# EAGLE design Matrix2 (EAGLE 5.06)
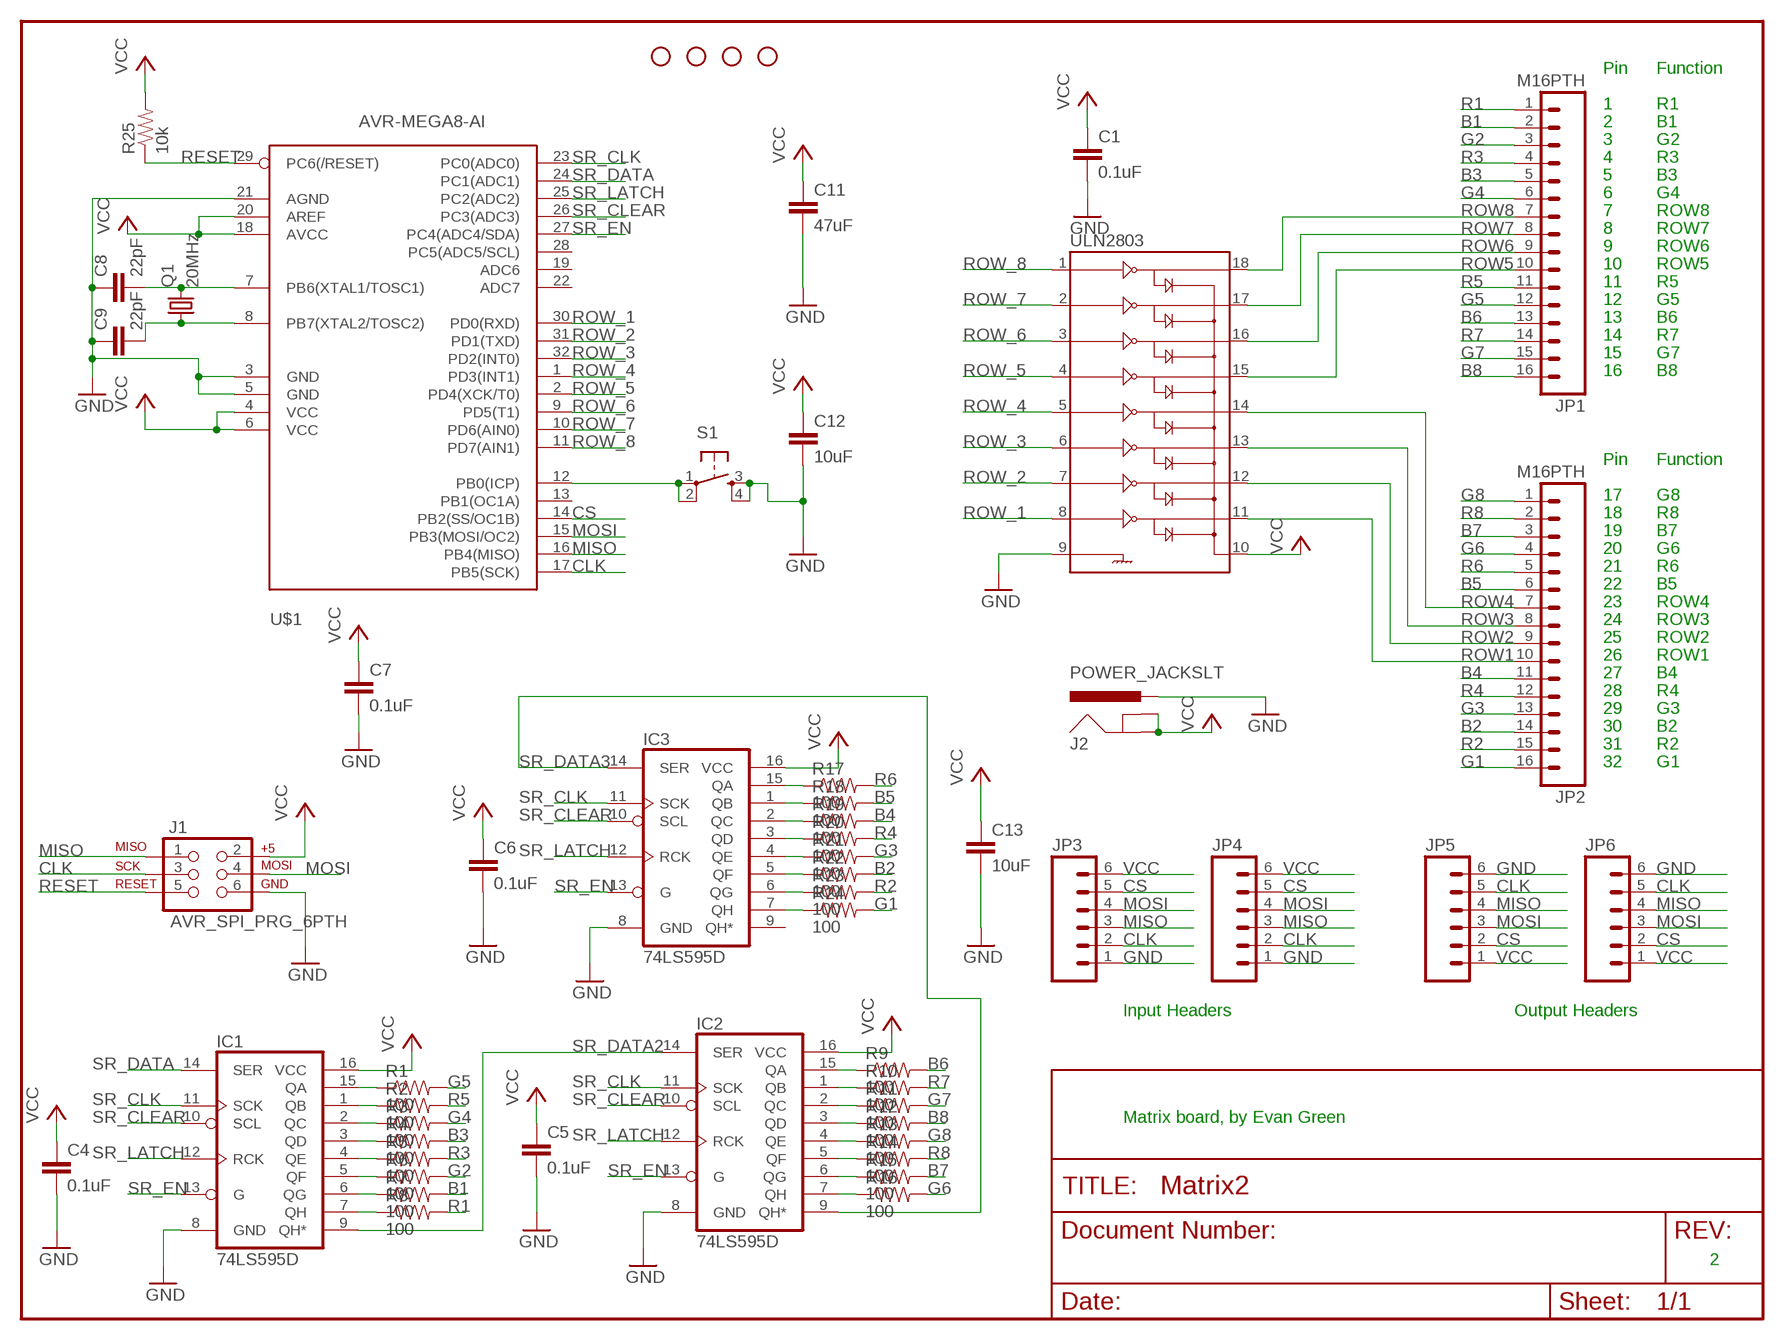
[diagram p0: schematic, sheet 1]

## Parts
C1  0.1uF  CAP0402-CAP  [0402-CAP]
C4  0.1uF  CAP0402-CAP  [0402-CAP]
C5  0.1uF  CAP0402-CAP  [0402-CAP]
C6  0.1uF  CAP0402-CAP  [0402-CAP]
C7  0.1uF  CAP0402-CAP  [0402-CAP]
C8  22pF  CAP0402-CAP  [0402-CAP]
C9  22pF  CAP0402-CAP  [0402-CAP]
C11  47uF  CAP1210  [1210]
C12  10uF  CAP1210  [1210]
C13  10uF  CAP1210  [1210]
IC1  74LS595D  [SO16]
IC2  74LS595D  [SO16]
IC3  74LS595D  [SO16]
J1  AVR_SPI_PRG_6PTH  [2X3]
J2  POWER_JACKSLT  [POWER_JACK_SLOT]
JP1  M16PTH  [1X16]
JP2  M16PTH  [1X16]
JP3  M06SIP  [1X06]
JP4  M06SIP  [1X06]
JP5  M06SIP  [1X06]
JP6  M06SIP  [1X06]
JP7  STAND-OFF  [STAND-OFF]
JP8  STAND-OFF  [STAND-OFF]
JP9  STAND-OFF  [STAND-OFF]
JP10  STAND-OFF  [STAND-OFF]
Q1  20MHz  CRYSTALHC49US  [HC49US]
R1  100  RESISTOR0402-RES  [0402-RES]
R2  100  RESISTOR0402-RES  [0402-RES]
R3  100  RESISTOR0402-RES  [0402-RES]
R4  100  RESISTOR0402-RES  [0402-RES]
R5  100  RESISTOR0402-RES  [0402-RES]
R6  100  RESISTOR0402-RES  [0402-RES]
R7  100  RESISTOR0402-RES  [0402-RES]
R8  100  RESISTOR0402-RES  [0402-RES]
R9  100  RESISTOR0402-RES  [0402-RES]
R10  100  RESISTOR0402-RES  [0402-RES]
R11  100  RESISTOR0402-RES  [0402-RES]
R12  100  RESISTOR0402-RES  [0402-RES]
R13  100  RESISTOR0402-RES  [0402-RES]
R14  100  RESISTOR0402-RES  [0402-RES]
R15  100  RESISTOR0402-RES  [0402-RES]
R16  100  RESISTOR0402-RES  [0402-RES]
R17  100  RESISTOR0402-RES  [0402-RES]
R18  100  RESISTOR0402-RES  [0402-RES]
R19  100  RESISTOR0402-RES  [0402-RES]
R20  100  RESISTOR0402-RES  [0402-RES]
R21  100  RESISTOR0402-RES  [0402-RES]
R22  100  RESISTOR0402-RES  [0402-RES]
R23  100  RESISTOR0402-RES  [0402-RES]
R24  100  RESISTOR0402-RES  [0402-RES]
R25  10k  RESISTOR0402-RES  [0402-RES]
S1  TAC_SWITCHSMD  [TACTILE_SWITCH_SMD]
U$1  AVR-MEGA8-AI  [TQFP32-08]
ULN2803  ULN2803SOICW  [SO18L]

## Nets
B1: JP1.2 R7.2
B2: JP2.14 R22.2
B3: JP1.5 R4.2
B4: JP2.11 R19.2
B5: JP2.6 R18.2
B6: JP1.13 R9.2
B7: JP2.3 R15.2
B8: JP1.16 R12.2
CLK: J1.3 JP3.2 JP4.2 JP5.5 JP6.5 U$1.17(PB5(SCK))
CS: JP3.5 JP4.5 JP5.2 JP6.2 U$1.14(PB2(SS/OC1B))
G1: JP2.16 R24.2
G2: JP1.3 R6.2
G3: JP2.13 R21.2
G4: JP1.6 R3.2
G5: JP1.12 R1.2
G6: JP2.4 R16.2
G7: JP1.15 R11.2
G8: JP2.1 R13.2
GND: C1.2 C4.2 C5.2 C6.2 C7.2 C8.1 C9.1 C11.2 C12.2 C13.2 IC1.8(GND) IC2.8(GND) IC3.8(GND) J1.6 J2.PWR JP3.1 JP4.1 JP5.6 JP6.6 S1.3 S1.4 U$1.3(GND) U$1.5(GND) U$1.21(AGND) ULN2803.9
MISO: J1.1 JP3.3 JP4.3 JP5.4 JP6.4 U$1.16(PB4(MISO))
MOSI: J1.4 JP3.4 JP4.4 JP5.3 JP6.3 U$1.15(PB3(MOSI/OC2))
N$1: IC1.15(QA) R1.1
N$2: IC1.1(QB) R2.1
N$3: IC1.2(QC) R3.1
N$4: IC1.3(QD) R4.1
N$5: IC1.4(QE) R5.1
N$6: IC1.5(QF) R6.1
N$7: IC1.6(QG) R7.1
N$8: IC1.7(QH) R8.1
N$9: IC2.15(QA) R9.1
N$10: IC2.1(QB) R10.1
N$11: IC2.2(QC) R11.1
N$12: IC2.3(QD) R12.1
N$13: IC2.4(QE) R13.1
N$14: IC2.5(QF) R14.1
N$15: IC2.6(QG) R15.1
N$16: IC2.7(QH) R16.1
N$17: IC3.15(QA) R17.1
N$18: IC3.1(QB) R18.1
N$19: IC3.2(QC) R19.1
N$20: IC3.3(QD) R20.1
N$21: IC3.4(QE) R21.1
N$22: IC3.5(QF) R22.1
N$23: IC3.6(QG) R23.1
N$24: IC3.7(QH) R24.1
N$25: C8.2 Q1.2 U$1.7(PB6(XTAL1/TOSC1))
N$26: C9.2 Q1.1 U$1.8(PB7(XTAL2/TOSC2))
N$27: S1.1 S1.2 U$1.12(PB0(ICP))
R1: JP1.1 R8.2
R2: JP2.15 R23.2
R3: JP1.4 R5.2
R4: JP2.12 R20.2
R5: JP1.11 R2.2
R6: JP2.5 R17.2
R7: JP1.14 R10.2
R8: JP2.2 R14.2
RESET: J1.5 R25.1 U$1.29(PC6(/RESET))
ROW1: JP2.10 ULN2803.11
ROW2: JP2.9 ULN2803.12
ROW3: JP2.8 ULN2803.13
ROW4: JP2.7 ULN2803.14
ROW5: JP1.10 ULN2803.15
ROW6: JP1.9 ULN2803.16
ROW7: JP1.8 ULN2803.17
ROW8: JP1.7 ULN2803.18
ROW_1: U$1.30(PD0(RXD)) ULN2803.8
ROW_2: U$1.31(PD1(TXD)) ULN2803.7
ROW_3: U$1.32(PD2(INT0)) ULN2803.6
ROW_4: U$1.1(PD3(INT1)) ULN2803.5
ROW_5: U$1.2(PD4(XCK/T0)) ULN2803.4
ROW_6: U$1.9(PD5(T1)) ULN2803.3
ROW_7: U$1.10(PD6(AIN0)) ULN2803.2
ROW_8: U$1.11(PD7(AIN1)) ULN2803.1
SR_CLEAR: IC1.10(SCL) IC2.10(SCL) IC3.10(SCL) U$1.26(PC3(ADC3))
SR_CLK: IC1.11(SCK) IC2.11(SCK) IC3.11(SCK) U$1.23(PC0(ADC0))
SR_DATA: IC1.14(SER) U$1.24(PC1(ADC1))
SR_DATA2: IC1.9(QH*) IC2.14(SER)
SR_DATA3: IC2.9(QH*) IC3.14(SER)
SR_EN: IC1.13(G) IC2.13(G) IC3.13(G) U$1.27(PC4(ADC4/SDA))
SR_LATCH: IC1.12(RCK) IC2.12(RCK) IC3.12(RCK) U$1.25(PC2(ADC2))
VCC: C1.1 C4.1 C5.1 C6.1 C7.1 C11.1 C12.1 C13.1 IC1.16(VCC) IC2.16(VCC) IC3.16(VCC) J1.2 J2.GND@1(GNDBREAK) J2.GND@2(GND) JP3.6 JP4.6 JP5.1 JP6.1 R25.2 U$1.4(VCC) U$1.6(VCC) U$1.18(AVCC) U$1.20(AREF) ULN2803.10
Unconnected: IC3.9(QH*) U$1.13(PB1(OC1A)) U$1.19(ADC6) U$1.22(ADC7) U$1.28(PC5(ADC5/SCL))

## Notes on the sheet
- Pin | Function
- 1 | R1
- 2 | B1
- 3 | G2
- 4 | R3
- 5 | B3
- 6 | G4
- 7 | ROW8
- 8 | ROW7
- 9 | ROW6
- 10 | ROW5
- 11 | R5
- 12 | G5
- 13 | B6
- 14 | R7
- 15 | G7
- 16 | B8
- Pin | Function
- 17 | G8
- 18 | R8
- 19 | B7
- 20 | G6
- 21 | R6
- 22 | B5
- 23 | ROW4
- 24 | ROW3
- 25 | ROW2
- 26 | ROW1
- 27 | B4
- 28 | R4
- 29 | G3
- 30 | B2
- 31 | R2
- 32 | G1
- Input Headers | Output Headers
- Matrix board, by Evan Green
- 2

## Library data of the parts
C1 C4-C9 C11-C13 = SparkFun:CAP: Capacitor Standard 0603 ceramic capacitor, and 0.1" leaded capacitor.
IC1-IC3 = SparkFun:74*595: 8-bit SHIFT REGISTER, output latch
J1 = SparkFun:AVR_SPI_PRG_6: AVR ISP 6 Pin This is the reduced ISP connector for AVR programming. Common on Arduino. This footprint will take up less PCB space and can be used with a 10-pin to 6-pin adapter such as SKU: BOB-08508
J2 = SparkFun:POWER_JACK: Power Jack This is the standard 5.5mm barrel jack for power. The PTH is the most common, proven, reliable, footprint. All others are experimental. The Slot footprint only works if the mill layer is transmitted to the PCB fab house so be warned. Spark Fun Electronics SKU : PRT-00119. Mating wall wart : TOL-00298 (and others)
JP1 JP2 = SparkFun:M16
JP3-JP6 = SparkFun:M06: Header 6 Standard 6-pin 0.1" header. Use with straight break away headers (SKU : PRT-00116), right angle break away headers (PRT-00553), swiss pins (PRT-00743), machine pins (PRT-00117), and female headers (PRT-00115). Molex polarized connector foot print use with SKU : PRT-08094 with associated crimp pins and housings. NOTES ON THE VARIANTS LOCK and LOCK_LONGPADS... This footprint was designed to help hold the alignment of a through-hole component (i.e. 6-pin header) while soldering it into place. You may notice that each hole has been shifted either up or down by 0.005 of an inch from it's more standard position (which is a perfectly straight line). This slight alteration caused the pins (the squares in the middle) to touch the edges of the holes. Because they are alternating, it causes a "brace" to hold the component in place. 0.005 has proven to be the perfect amount of "off-center" position when using our standard breakaway headers. Although looks a little odd when you look at the bare footprint, once you have a header in there, the alteration is very hard to notice. Also, if you push a header all the way into place, it is covered up entirely on the bottom side. This idea of altering the position of holes to aid alignment will be further integrated into the Sparkfun Library for other footprints. It can help hold any component with 3 or more connection pins.
JP7-JP10 = SparkFun:STAND-OFF: Stand Off This is the mechanical footprint for a #4 phillips button head screw. Use the keepout ring to avoid running the screw head into surrounding components. SKU : PRT-00447
Q1 = SparkFun:CRYSTAL: Crystals Various standard crystals. Proven footprints. Spark Fun Electronics SKU : COM-00534
R1-R25 = SparkFun:RESISTOR: Resistor Basic schematic elements and footprints for 0603, 1206, and PTH 1/10th watt (small) resistors.
S1 = SparkFun:TAC_SWITCH: Momentary Switch Button commonly used for reset or general input. Spark Fun Electronics SKU : COM-00097
U$1 = SparkFun:AVR-MEGA8: MICROCONTROLLER 8 Kbytes FLASH 1 kbytes SRAM 512 bytes EEPROM USART 6-channel 10 bit ADC 2-channel 8 bit ADC
ULN2803 = SparkFun:ULN2803: Darlington Driver ULN2803 Darlington array. 500mA max per channel, 8-channel package. Spark Fun Electronics SKU : COM-00312

## Board
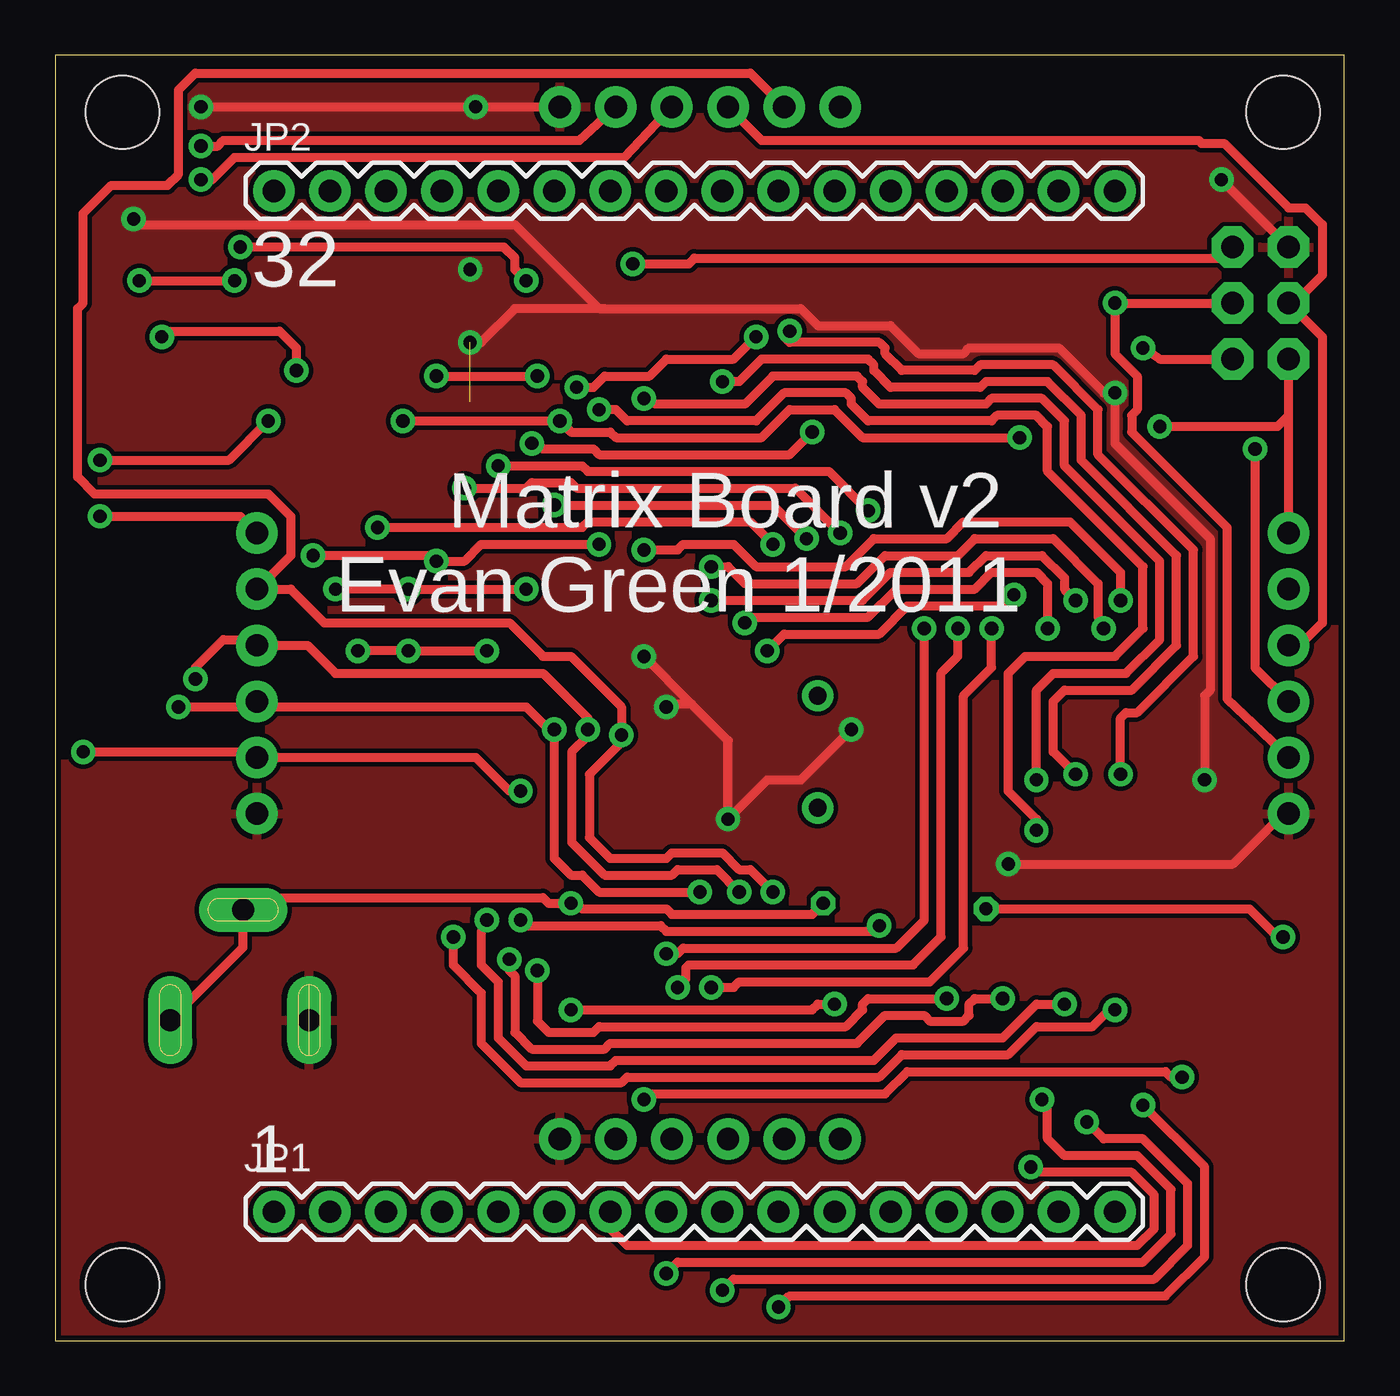
[diagram p1: board, top side]
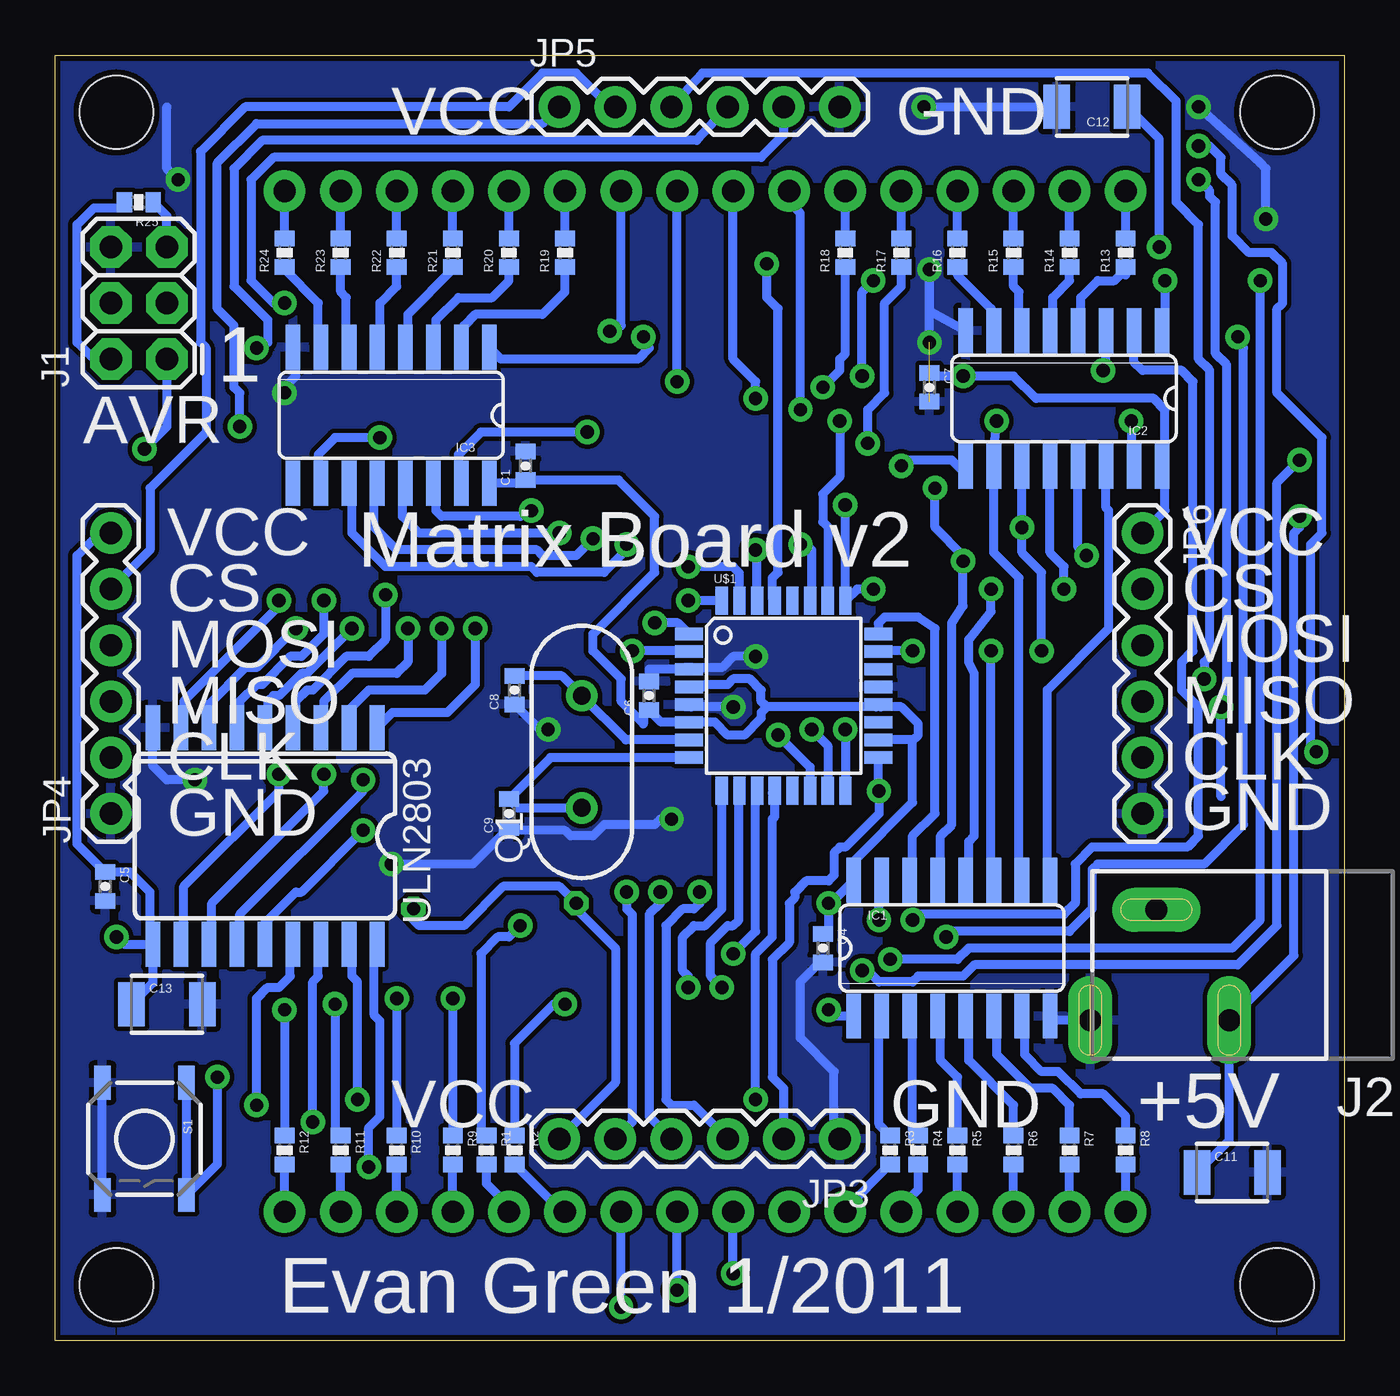
[diagram p2: board, bottom side, seen from below]

Size 58.4 x 58.22 mm. Coordinates in mm from the lower left corner, seen from the top.
Outline: 0,0 58.4,0 58.4,58.22 0,58.22 0,0
Copper layers (1*16): Top 0.035mm / dielectric 1.5mm / Bottom 0.035mm
Design rules "SparkFun": minimum track width 8mil, minimum drill 20mil, track to track 8mil, track to pad 8mil, pad to pad 8mil, via to via 8mil, smd to smd 8mil, copper to edge 10mil, drill to drill 8mil, minimum pad ring 12mil, minimum via ring 10mil, stop-mask expansion 4mil, vias tented up to drill 25mil, thermal gap 10mil

### Footprints (pad centres in the part's own frame; a part is rotated, then mirrored left to right if it is on the bottom)
0402-CAP = smd 0.7 x 0.9: 1 -0.65,0; 2 0.65,0
1210 = smd 1.2 x 2: 1 -1.6,0; 2 1.6,0
SO16 = smd 0.66 x 2.032: 1 -4.445,-3.073; 2 -3.175,-3.073; 3 -1.905,-3.073; 4 -0.635,-3.073; 5 0.635,-3.073; 6 1.905,-3.073; 7 3.175,-3.073; 8 4.445,-3.073; 9 4.445,3.073; 10 3.175,3.073; 11 1.905,3.073; 12 0.635,3.073; 13 -0.635,3.073; 14 -1.905,3.073; 15 -3.175,3.073; 16 -4.445,3.073
2X3 = drill 1.016 pad 1.88 octagon: 1 0,0; 2 0,2.54; 3 2.54,0; 4 2.54,2.54; 5 5.08,0; 6 5.08,2.54
POWER_JACK_SLOT = drill 1 pad 2 long: GND@1 2.58,7.5; GND@2 7.58,10.8; PWR 2.58,13.8
1X16 = drill 1.016 pad 1.88 round: 1 0,0; 2 2.54,0; 3 5.08,0; 4 7.62,0; 5 10.16,0; 6 12.7,0; 7 15.24,0; 8 17.78,0; 9 20.32,0; 10 22.86,0; 11 25.4,0; 12 27.94,0; 13 30.48,0; 14 33.02,0; 15 35.56,0; 16 38.1,0
1X06 = drill 1.016 pad 1.88 round: 1 0,0; 2 2.54,0; 3 5.08,0; 4 7.62,0; 5 10.16,0; 6 12.7,0
STAND-OFF = hole 3.302: 0,0
HC49US = drill 0.813 round: 1 -2.54,0; 2 2.54,0
0402-RES = smd 0.7 x 0.9: 1 -0.65,0; 2 0.65,0
TACTILE_SWITCH_SMD = smd 1.524 x 0.762: 1 -2.54,1.905; 2 2.54,1.905; 3 -2.54,-1.905; 4 2.54,-1.905
TQFP32-08 = smd 1.27 x 0.559: 1 -4.293,2.8; 2 -4.293,2; 3 -4.293,1.2; 4 -4.293,0.4; 5 -4.293,-0.4; 6 -4.293,-1.2; 7 -4.293,-2; 8 -4.293,-2.8; 17 4.293,-2.8; 18 4.293,-2; 19 4.293,-1.2; 20 4.293,-0.4; 21 4.293,0.4; 22 4.293,1.2; 23 4.293,2; 24 4.293,2.8 | smd 0.559 x 1.27: 9 -2.8,-4.293; 10 -2,-4.293; 11 -1.2,-4.293; 12 -0.4,-4.293; 13 0.4,-4.293; 14 1.2,-4.293; 15 2,-4.293; 16 2.8,-4.293; 25 2.8,4.293; 26 2,4.293; 27 1.2,4.293; 28 0.4,4.293; 29 -0.4,4.293; 30 -1.2,4.293; 31 -2,4.293; 32 -2.8,4.293
SO18L = smd 0.66 x 2.032: 1 -0.635,-4.902; 2 0.635,-4.902; 3 1.905,-4.902; 4 3.175,-4.902; 5 4.445,-4.902; 6 5.715,-4.902; 7 6.985,-4.902; 8 8.255,-4.902; 9 9.525,-4.902; 10 9.525,4.902; 11 8.255,4.902; 12 6.985,4.902; 13 5.715,4.902; 14 4.445,4.902; 15 3.175,4.902; 16 1.905,4.902; 17 0.635,4.902; 18 -0.635,4.902

### Placement (x,y rotation side)
C1  37.08,39.62 90 bottom
C4  23.62,17.78 270 bottom
C5  56.13,20.57 270 bottom
C6  31.5,29.21 90 bottom
C7  18.8,43.18 270 bottom
C8  37.59,29.46 90 bottom
C9  37.85,23.88 90 bottom
C11  5.08,7.62 0 bottom
C12  11.43,55.88 180 bottom
C13  53.34,15.24 0 bottom
IC1  17.78,17.78 0 bottom
IC2  12.7,42.67 180 bottom
IC3  43.18,41.91 180 bottom
J1  53.34,44.45 90 bottom
J2  -2.29,11.94 90 bottom
JP1  9.91,5.84 0 top
JP2  9.91,52.07 0 top
JP3  22.86,9.14 180 bottom
JP4  55.88,23.88 90 bottom
JP5  35.56,55.88 0 bottom
JP6  9.14,36.58 270 bottom
JP7  3.05,2.54 0 top
JP8  3.05,55.63 0 top
JP9  55.63,55.63 0 top
JP10  55.63,2.54 0 top
Q1  34.54,26.67 90 bottom
R1  38.86,8.64 270 bottom
R2  37.59,8.64 270 bottom
R3  20.57,8.64 270 bottom
R4  19.3,8.64 270 bottom
R5  17.53,8.64 270 bottom
R6  14.99,8.64 270 bottom
R7  12.45,8.64 270 bottom
R8  9.91,8.64 270 bottom
R9  40.39,8.64 270 bottom
R10  42.93,8.64 270 bottom
R11  45.47,8.64 270 bottom
R12  48.01,8.64 270 bottom
R13  9.91,49.28 90 bottom
R14  12.45,49.28 90 bottom
R15  14.99,49.28 90 bottom
R16  17.53,49.28 90 bottom
R17  20.07,49.28 90 bottom
R18  22.61,49.28 90 bottom
R19  35.31,49.28 90 bottom
R20  37.85,49.28 90 bottom
R21  40.39,49.28 90 bottom
R22  42.93,49.28 90 bottom
R23  45.47,49.28 90 bottom
R24  48.01,49.28 90 bottom
R25  54.61,51.56 180 bottom
S1  54.36,9.14 270 bottom
U$1  25.4,29.21 0 bottom
ULN2803  44.45,22.86 180 bottom

### Tracks (layer width: path | path; a pad name or v marks a point on that pad's centre or on a via)
B1
  Bottom 0.406: JP1.2 R7.2
B2
  Bottom 0.406: R22.2 JP2.14
B3
  Bottom 0.406: R4.2 19.3,6.86 20.07,6.1 JP1.5
B4
  Bottom 0.406: R19.2 JP2.11
B5
  Bottom 0.406: R18.2 JP2.6
B6
  Bottom 0.406: JP1.13 R9.2
B7
  Bottom 0.406: R15.2 JP2.3
B8
  Bottom 0.406: JP1.16 R12.2
CLK  (via drill 0.6)
  Top 0.406: v21.08,24.89 20.57,24.89 19.05,26.42 JP6.5 8.89,26.67 v1.27,26.67 | JP5.5 23.75,54.36 7.62,54.36 7.37,54.1 v6.6,54.1 | JP4.2 53.09,29.08 53.09,36.83 48.77,41.15 48.77,41.91 49.02,42.16 49.02,43.69 48.01,44.7 v48.01,46.99 J1.3
  Bottom 0.406: U$1.17 21.11,24.92 v21.08,24.89 21.08,23.88 22.61,22.35 22.86,22.35 23.11,22.1 23.11,21.08 23.37,20.83 24.38,20.83 24.89,20.32 24.89,20.07 25.15,19.81 25.15,18.03 25.91,17.27 25.91,11.94 25.4,11.43 JP3.2 | JP5.5 25.4,54.61 26.42,53.59 48.51,53.59 49.53,52.58 49.53,48.01 48.51,46.99 v48.01,46.99 | v1.27,26.67 1.52,26.92 1.52,36.07 1.02,36.58 1.02,40.89 3.05,42.93 3.05,46.74 2.79,46.99 2.79,48.77 3.3,49.28 4.32,49.28 5.08,50.04 5.08,52.32 5.59,52.83 5.59,53.59 6.1,54.1 v6.6,54.1
CS  (via drill 0.6)
  Top 0.406: v32.51,20.32 31.5,21.34 30.99,21.34 30.23,22.1 27.94,22.1 27.69,21.84 25.15,21.84 24.2,22.79 24.2,25.65 25.65,27.11 v25.65,27.43 25.65,28.7 23.37,30.99 22.1,30.99 20.57,32.51 12.19,32.51 10.67,34.04 JP6.2 10.67,35.56 10.67,37.34 9.65,38.35 1.78,38.35 1.02,39.12 1.02,46.74 1.27,46.99 1.27,51.05 2.54,52.32 5.08,52.32 5.59,52.83 5.59,56.64 6.35,57.4 31.5,57.4 JP5.2
  Bottom 0.406: v25.65,27.43 24.2,25.98 U$1.14 | JP5.2 33.27,55.88 34.8,57.4 36.32,57.4 37.85,55.88 49.78,55.88 51.82,53.85 51.82,45.21 51.56,44.96 51.56,41.15 54.1,38.61 54.1,35.81 JP4.5 | JP3.5 32.26,9.91 32.26,19.3 32.51,19.56 v32.51,20.32
G1
  Bottom 0.406: R24.2 JP2.16
G2
  Bottom 0.406: JP1.3 R6.2
G3
  Bottom 0.406: R21.2 JP2.13
G4
  Bottom 0.406: R3.2 22.61,5.95 JP1.6
G5
  Bottom 0.406: R1.2 38.86,7.11 37.85,6.1 JP1.12
G6
  Bottom 0.406: R16.2 JP2.4
G7
  Bottom 0.406: JP1.15 R11.2
G8
  Bottom 0.406: R13.2 JP2.1
GND  (via drill 0.6)  (1 unrouted)
  Top 0.406: v36.07,27.69 33.78,25.4 32.26,25.4 v30.48,23.62 30.48,27.18 28.83,28.83 | 28.83,28.83 v26.67,30.99 | v27.69,28.7 27.56,28.83 28.83,28.83 | v52.07,25.4 52.07,29.21 52.32,29.46 52.32,36.32 48.01,40.64 v48.01,42.93 47.5,42.93 45.47,44.96 41.4,44.96 41.15,44.7 39.12,44.7 37.85,45.97 34.54,45.97 33.78,46.74 24.89,46.74 | 18.8,45.47 v18.8,45.21 19.3,45.21 20.83,46.74 24.89,46.74 | v43.18,21.59 53.34,21.59 55.63,23.88 JP4.1 | J1.6 v52.83,52.58 | JP5.6 v19.05,55.88 v6.6,55.88 | v3.56,50.8 3.81,50.55 20.83,50.55 24.64,46.74 24.89,46.74
  Bottom 0.406: IC2.8 18.8,46.63 v18.8,48.51 v18.8,45.21 | C8.1 36.46,27.69 v36.07,27.69 | v26.67,30.99 27.69,30.99 28.19,30.48 29.62,30.48 U$1.3 31.5,30.41 C6.2 | U$1.5 29.59,28.7 v27.69,28.7 | 47.75,45.11 IC3.8 47.5,44.86 47.5,43.69 48.01,43.18 v48.01,42.93 | v52.07,25.4 53.34,25.4 53.98,26.04 ULN2803.9 | S1.4 S1.3 | v30.48,23.62 30.99,23.62 31.24,23.37 33.53,23.37 34.04,22.86 35.05,22.86 35.31,23.11 37.73,23.11 C9.1 39.48,21.59 v43.18,21.59 | J2.PWR 13.34,14.52 IC1.8 | v52.83,52.58 53.34,53.09 53.34,55.88 | v19.05,55.88 C12.2 | JP3.1 23.11,9.4 23.11,12.19 24.64,13.72 24.64,16.26 23.76,17.13 C4.2 | v6.6,55.88 3.81,53.34 3.56,53.09 v3.56,50.8
  pour Top: 0,0 58.42,0 58.42,58.17 0,58.17
  pour Bottom: 0,58.17 0,0 58.42,0 58.42,58.17
MISO  (via drill 0.6)
  Top 0.406: JP5.4 25.78,53.59 8.13,53.59 7.11,52.58 v6.6,52.58 | v29.21,20.32 24.64,20.32 23.88,21.08 23.37,21.08 22.61,21.84 v22.61,27.69 22.35,27.69 21.34,28.7 9.4,28.7 JP6.4 8.89,28.7 v5.59,28.7 | v49.28,44.96 50.04,44.45 J1.1 | JP4.3 54.36,30.48 v54.36,40.39
  Bottom 0.406: v22.61,27.69 v22.6,27.68 U$1.16 | v6.6,52.58 6.1,52.07 6.1,51.82 5.84,51.56 5.84,44.7 5.33,44.2 5.33,29.21 5.59,28.96 v5.59,28.7 5.59,24.64 | JP5.4 29.34,54.36 49.02,54.36 50.29,53.09 50.29,47.75 48.77,46.23 48.77,45.21 49.02,44.96 v49.28,44.96 | v29.21,20.32 29.21,19.81 29.46,19.56 29.97,19.56 30.73,18.8 30.73,10.92 30.48,10.67 29.46,10.67 JP3.3 | v54.36,40.39 53.34,41.4 J1.1
MOSI  (via drill 0.6)
  Top 0.406: v30.99,20.32 29.97,21.34 28.19,21.34 27.94,21.08 24.89,21.08 23.4,22.57 23.4,26.67 24.13,27.4 v24.13,27.69 24.13,28.19 22.1,30.23 12.7,30.23 11.43,31.5 JP6.3 8.89,31.75 7.62,31.75 6.35,30.48 v6.35,29.97 | JP4.4 56.39,31.5 57.4,32.51 57.4,45.47 J1.4 56.13,46.99 57.4,48.26 57.4,50.55 56.64,51.31 55.88,51.31 52.96,54.23 51.94,54.23 51.82,54.36 32,54.36 JP5.3
  Bottom 0.406: v24.13,27.69 23.4,26.96 U$1.15 | JP5.3 29.08,57.4 8.89,57.4 7.62,56.13 7.62,51.56 6.6,50.55 6.6,44.45 6.1,43.94 6.1,30.99 6.35,30.73 v6.35,29.97 | JP3.4 31.5,10.16 31.5,19.3 30.99,19.81 v30.99,20.32
N$1  (via drill 0.6)
  Top 0.406: v21.08,19.05 21.34,18.8 27.43,18.8 27.69,18.54 37.08,18.54 v37.34,18.8
  Bottom 0.406: IC1.15 21.08,20.73 v21.08,19.05 | v37.34,18.8 37.85,18.29 38.35,18.29 39.12,17.53 39.12,9.54 R1.1
N$2  (via drill 0.6)
  Top 0.406: v23.37,14.99 34.29,14.99 34.54,15.24 v35.31,15.24
  Bottom 0.406: v23.37,14.99 23.09,14.71 IC1.1 | R2.1 37.59,13.46 35.81,15.24 v35.31,15.24
N$3
  Bottom 0.406: IC1.2 21.08,14.58 21.08,9.79 R3.1
N$4
  Bottom 0.406: IC1.3 19.56,14.58 19.56,9.54 R4.1
N$5
  Bottom 0.406: IC1.4 18.29,14.58 18.29,12.7 17.53,11.94 R5.1
N$6
  Bottom 0.406: IC1.5 17.02,14.58 17.02,12.7 14.99,10.67 R6.1
N$7
  Bottom 0.406: IC1.6 15.75,14.58 15.75,12.95 14.22,11.43 13.21,11.43 12.45,10.67 R7.1
N$8
  Bottom 0.406: IC1.7 14.48,14.58 14.48,12.95 13.72,12.19 12.95,12.19 11.94,11.18 10.92,11.18 9.91,10.16 R8.1
N$9  (via drill 0.6)
  Top 0.406: v40.39,15.49 36.83,15.49 36.58,15.24 36.58,14.99 35.81,14.22 24.64,14.22 24.38,13.97 22.35,13.97 21.84,14.48 v21.84,16.76 | v9.65,41.66 7.87,39.88 v2.03,39.88
  Bottom 0.406: v40.39,15.49 R9.1 | v21.84,16.76 21.59,16.76 21.08,16.26 19.56,16.26 19.3,16.51 17.27,16.51 16.76,17.02 4.83,17.02 3.05,18.8 3.05,38.86 v2.03,39.88 | IC2.15 9.65,39.73 v9.65,41.66
N$10  (via drill 0.6)
  Top 0.406: v42.93,15.49 41.66,15.49 41.4,15.24 41.4,14.73 41.15,14.48 39.62,14.48 39.37,14.73 37.59,14.73 36.32,13.46 25.15,13.46 24.89,13.21 21.59,13.21 20.83,13.97 20.83,16.51 20.57,16.76 v20.57,17.27 | v3.81,48.01 v8.13,48.01
  Bottom 0.406: v42.93,15.49 R10.1 | IC2.1 8.13,45.87 v8.13,48.01 | v3.81,48.01 3.81,19.05 5.08,17.78 17.02,17.78 17.53,17.27 v20.57,17.27
N$11  (via drill 0.6)
  Top 0.406: v45.72,15.24 44.45,15.24 42.93,13.72 38.1,13.72 37.08,12.7 25.4,12.7 25.15,12.45 21.34,12.45 20.07,13.72 20.07,16.26 19.3,17.02 19.3,18.54 19.56,18.8 v19.56,19.05
  Bottom 0.406: R11.1 45.72,9.54 v45.72,15.24 | v19.56,19.05 19.3,19.3 12.7,19.3 12.19,19.81 12.19,21.59 11.43,22.35 7.11,22.35 6.6,22.86 6.6,28.7 7.37,29.46 7.37,30.73 6.86,31.24 6.86,43.43 7.37,43.94 9.14,43.94 9.53,44.32 IC2.2
N$12  (via drill 0.6)
  Top 0.406: v18.03,18.29 18.03,17.02 19.3,15.75 19.3,13.46 21.08,11.68 25.65,11.68 25.91,11.94 37.34,11.94 38.35,12.95 43.18,12.95 44.45,14.22 46.99,14.22 47.75,14.99 v48.01,14.99 | v4.83,45.47 5.08,45.72 10.16,45.72 10.92,44.96 v10.92,43.94
  Bottom 0.406: v48.01,14.99 R12.1 | v4.83,45.47 4.83,45.21 4.57,44.96 4.57,23.37 6.35,21.59 11.18,21.59 11.43,21.34 11.43,19.56 12.45,18.54 17.78,18.54 v18.03,18.29 | v10.92,43.94 10.79,44.07 IC2.3
N$13
  Bottom 0.406: IC2.4 11.94,45.11 11.94,47.24 11.18,48.01 10.41,48.01 9.91,48.51 R13.1 9.91,48.26
N$14
  Bottom 0.406: IC2.5 13.21,45.11 13.21,47.24 12.45,48.01 R14.1
N$15
  Bottom 0.406: IC2.6 14.73,45.11 14.73,47.5 14.99,47.75 R15.1
N$16
  Bottom 0.406: IC2.7 16,45.11 16,46.74 17.53,48.26 R16.1
N$17  (via drill 0.6)
  Top 0.406: v34.29,41.15 33.27,40.13 24.64,40.13 24.38,40.39 22.1,40.39 21.84,40.64 v21.59,40.64
  Bottom 0.406: IC3.15 40.13,38.96 40.13,40.13 39.12,41.15 v34.29,41.15 | v21.59,40.64 21.59,42.16 20.83,42.93 20.83,46.99 20.07,47.75 R17.1
N$18  (via drill 0.6)
  Top 0.406: v31.75,45.47 30.73,44.45 27.69,44.45 26.92,43.69 24.89,43.69 24.38,43.18 v23.62,43.18
  Bottom 0.406: IC3.1 38.2,44.45 32,44.45 31.5,44.96 v31.75,45.47 | v23.62,43.18 22.86,43.94 22.86,44.45 22.61,44.7 R18.1
N$19
  Bottom 0.406: IC3.2 39.88,45.11 39.88,45.97 39.37,46.48 36.32,46.48 35.31,47.5 R19.1
N$20
  Bottom 0.406: IC3.3 41.15,45.11 41.15,46.23 40.13,47.24 38.61,47.24 37.85,48.01 R20.1
N$21
  Bottom 0.406: IC3.4 42.42,45.11 42.42,46.48 40.39,48.51 R21.1
N$22
  Bottom 0.406: IC3.5 43.69,45.11 43.69,46.99 42.93,47.75 R22.1
N$23
  Bottom 0.406: IC3.6 45.21,45.11 45.21,47.24 45.47,47.5 R23.1
N$24
  Bottom 0.406: IC3.7 46.48,45.11 46.48,46.99 48.01,48.51 R24.1
N$25
  Bottom 0.406: U$1.7 32.54,27.21 Q1.2 35.45,30.11 C8.2
N$26
  Bottom 0.406: U$1.8 35.96,26.41 C9.2 37.45,24.13 Q1.1
N$27  (via drill 0.6)
  Top 0.406: v26.67,10.92 26.92,11.18 37.59,11.18 38.61,12.19 50.29,12.19 50.55,11.94 v51.05,11.94
  Bottom 0.406: 25.91,24.81 U$1.12 25.8,23.73 25.91,23.62 25.91,18.29 26.67,17.53 v26.67,10.92 | S1.1 S1.2 51.05,8 v51.05,11.94
R1
  Bottom 0.406: JP1.1 R8.2
R2
  Bottom 0.406: R23.2 JP2.15
R3
  Bottom 0.406: JP1.4 R5.2
R4
  Bottom 0.406: R20.2 JP2.12
R5
  Bottom 0.406: R2.2 35.58,5.97 JP1.11
R6
  Bottom 0.406: R17.2 JP2.5
R7
  Bottom 0.406: JP1.14 R10.2
R8
  Bottom 0.406: R14.2 JP2.2
RESET  (via drill 0.6)
  Top 0.406: J1.5 52.83,49.02 28.96,49.02 28.7,48.77 v26.16,48.77
  Bottom 0.406: U$1.29 25.91,33.61 25.91,34.54 25.65,34.8 25.65,46.74 26.16,47.24 v26.16,48.77 | R25.1 53.34,50.94 J1.5
ROW1  (via drill 0.6)
  Top 0.406: v48.26,25.65 48.26,28.19 48.51,28.45 49.02,28.45 51.56,30.99 51.56,35.81 47.24,40.13 47.24,42.16 45.21,44.2 41.91,44.2 41.66,43.94 38.35,43.94 37.59,44.7 37.59,44.96 37.34,45.21 33.27,45.21 33.02,45.47 v33.27,45.72
  Bottom 0.406: v33.27,45.72 32.77,45.97 JP2.10 | ULN2803.11 52.58,18.09 52.58,20.57 48.26,24.89 v48.26,25.65
ROW2  (via drill 0.6)
  Top 0.406: v46.23,25.65 45.21,26.67 45.21,28.96 45.72,29.46 48.77,29.46 50.8,31.5 50.8,35.56 46.48,39.88 46.48,41.91 44.96,43.43 42.16,43.43 41.91,43.18 37.85,43.18 37.08,43.94 37.08,44.2 36.83,44.45 32,44.45 30.99,43.43 v30.23,43.43
  Bottom 0.406: v30.23,43.43 JP2.9 | ULN2803.12 51.31,18.09 51.31,19.81 46.23,24.89 v46.23,25.65
ROW3  (via drill 0.6)
  Top 0.406: v26.67,42.67 26.92,42.67 27.18,42.42 31.24,42.42 32.51,43.69 36.32,43.69 36.58,43.43 36.58,43.18 37.34,42.42 42.16,42.42 42.42,42.67 44.7,42.67 45.72,41.66 45.72,39.62 50.04,35.31 50.04,31.75 48.51,30.23 45.21,30.23 44.45,29.46 v44.45,25.4
  Bottom 0.406: JP2.8 27.69,44.45 26.67,43.43 v26.67,42.67 | ULN2803.13 50.04,18.09 50.04,19.3 44.45,24.89 v44.45,25.4
ROW4  (via drill 0.6)
  Top 0.406: v24.64,42.16 25.4,42.16 25.91,41.66 31.75,41.66 33.02,42.93 35.81,42.93 36.07,42.67 36.07,42.42 36.83,41.66 42.42,41.66 42.67,41.91 44.45,41.91 44.96,41.4 44.96,39.37 49.28,35.05 49.28,32.26 48.01,30.99 43.94,30.99 43.18,30.23 43.18,24.89 44.45,23.62 v44.45,23.11
  Bottom 0.406: v24.64,42.16 24.64,51.05 25.15,51.56 JP2.7 | v44.45,23.11 47.24,20.32 47.5,20.32 48.9,18.92 ULN2803.14
ROW5  (via drill 0.6)
  Top 0.406: v49.28,10.67 52.07,7.87 52.07,3.81 50.29,2.03 33.27,2.03 v32.77,1.52
  Bottom 0.406: ULN2803.15 47.75,17.83 47.75,16.51 48.26,16 48.77,16 49.28,15.49 v49.28,10.67 | v32.77,1.52 JP1.10
ROW6  (via drill 0.6)
  Top 0.406: v46.74,9.91 47.5,9.14 49.28,9.14 51.31,7.11 51.31,4.32 49.78,2.79 30.73,2.79 v30.23,2.29
  Bottom 0.406: ULN2803.16 46.48,17.83 46.48,16.51 46.74,16.26 v46.74,9.91 | v30.23,2.29 JP1.9
ROW7  (via drill 0.6)
  Top 0.406: v44.7,10.92 44.96,10.67 44.96,9.14 45.72,8.38 49.02,8.38 50.55,6.86 50.55,4.83 49.28,3.56 28.19,3.56 v27.69,3.05
  Bottom 0.406: ULN2803.17 44.96,17.83 44.96,16.51 44.7,16.26 v44.7,10.92 | v27.69,3.05 JP1.8
ROW8  (via drill 0.6)
  Top 0.406: v44.2,7.87 44.45,7.62 48.77,7.62 49.78,6.6 49.78,5.08 49.02,4.32 25.91,4.32 25.15,5.08 JP1.7
  Bottom 0.406: ULN2803.18 43.94,17.83 43.94,14.73 43.69,14.48 43.69,10.16 44.2,9.65 v44.2,7.87
ROW_1  (via drill 0.6)
  Top 0.406: v48.26,33.53 48.26,34.8 45.97,37.08 41.15,37.08 40.39,36.32 37.08,36.32 35.81,35.05 31.75,35.05 30.73,36.07 28.45,36.07 28.19,35.81 v26.67,35.81
  Bottom 0.406: v26.67,35.81 26.6,35.74 U$1.30 | ULN2803.8 52.58,27.89 52.58,28.96 48.26,33.27 v48.26,33.53
ROW_2  (via drill 0.6)
  Top 0.406: v29.72,35.05 30.48,35.05 31.24,34.29 36.32,34.29 37.59,35.56 40.89,35.56 41.66,36.32 45.21,36.32 47.24,34.29 47.24,32.77 47.5,32.51 v47.5,32.26
  Bottom 0.406: v29.72,35.05 27.69,35.05 27.4,34.77 U$1.31 | v47.5,32.26 49.28,30.48 49.78,30.48 51.44,28.83 ULN2803.7
ROW_3  (via drill 0.6)
  Top 0.406: v46.23,33.53 45.72,34.04 45.72,34.54 44.7,35.56 42.16,35.56 41.4,34.8 37.85,34.8 36.58,33.53 v29.72,33.53
  Bottom 0.406: v29.72,33.53 29.69,33.5 U$1.32 | ULN2803.6 50.04,27.89 50.04,28.96 49.28,29.72 49.02,29.72 47.75,30.99 47.24,30.99 46.23,32 v46.23,33.53
ROW_4  (via drill 0.6)
  Top 0.406: v31.24,32.51 31.5,32.77 36.83,32.77 38.1,34.04 41.66,34.04 42.42,34.8 44.45,34.8 44.96,34.29 v44.96,32.26
  Bottom 0.406: U$1.1 30.2,32.51 v31.24,32.51 | ULN2803.5 48.77,27.89 48.77,28.96 48.51,29.21 48.26,29.21 47.24,30.23 46.99,30.23 v44.96,32.26
ROW_5  (via drill 0.6)
  Top 0.406: v32.26,31.24 33.02,32 37.34,32 38.61,33.27 42.93,33.27 v43.43,33.78
  Bottom 0.406: U$1.2 29.73,31.24 v32.26,31.24 | ULN2803.4 47.5,27.89 47.5,28.96 46.99,29.46 46.74,29.46 45.21,30.99 44.2,30.99 43.43,31.75 v43.43,33.78
ROW_6  (via drill 0.6)
  Top 0.406: v42.42,32.26 42.42,30.48 41.15,29.21 41.15,17.78 39.62,16.26 30.99,16.26 30.73,16 v29.72,16
  Bottom 0.406: U$1.9 28.19,19.56 28.96,18.8 29.46,18.8 29.97,18.29 29.97,16.76 29.72,16.51 v29.72,16 | ULN2803.3 46.23,27.89 46.23,28.96 44.96,30.23 42.93,30.23 42.42,30.73 v42.42,32.26
ROW_7  (via drill 0.6)
  Top 0.406: v40.89,32.26 40.89,30.99 40.13,30.23 40.13,18.29 38.86,17.02 28.7,17.02 28.57,16.89 28.57,16.38 v28.19,16
  Bottom 0.406: U$1.10 27.43,24.89 27.43,19.05 27.69,18.8 27.94,18.8 28.7,18.03 28.7,16.51 v28.19,16 | ULN2803.2 44.96,27.89 44.96,28.7 44.2,29.46 41.66,29.46 40.89,30.23 v40.89,32.26
ROW_8  (via drill 0.6)
  Top 0.406: v39.37,32.26 39.37,19.05 38.1,17.78 28.45,17.78 28.19,17.53 v27.69,17.53
  Bottom 0.406: U$1.11 26.67,24.85 26.67,18.54 v27.69,17.53 | ULN2803.1 43.13,28.45 40.64,28.45 39.37,29.72 v39.37,32.26
SR_CLEAR  (via drill 0.6)
  Top 0.406: v15.75,41.66 v22.86,41.66 23.37,41.15 25.15,41.15 25.4,40.89 32,40.89 33.27,42.16 35.31,42.16 36.58,40.89 v43.69,40.89
  Bottom 0.406: IC1.10 14.73,20.98 14.73,34.54 15.88,35.69 IC2.10 16,38.96 v15.75,41.66 | IC3.10 46.23,38.96 46.48,39.22 46.48,40.13 45.72,40.89 v43.69,40.89 | v22.86,41.66 22.86,39.12 23.62,38.35 23.62,37.08 23.4,36.86 U$1.26
SR_CLK  (via drill 0.6)
  Top 0.406: v13.72,31.24 v16,31.24 v19.56,31.24 | v32.51,36.07 31.5,37.08 24.13,37.08 23.88,36.83 v14.61,36.83
  Bottom 0.406: IC1.11 16,20.98 v16,31.24 | v13.72,31.24 13.72,34.8 14.61,35.69 v14.61,36.83 IC2.11 | U$1.23 21.07,31.24 v19.56,31.24 | IC3.11 44.96,38.71 44.96,36.58 43.43,35.05 36.83,35.05 36.58,34.8 33.53,34.8 32.51,35.81 v32.51,36.07
SR_DATA
  Bottom 0.406: IC1.14 19.56,20.98 19.56,22.86 18.54,23.88 18.54,32.26 19.3,32.77 20.83,32.77 21.11,32.49 U$1.24
SR_DATA2
  Bottom 0.406: IC1.9 13.46,20.98 13.46,29.46 10.67,32.26 10.67,37.59 10.79,37.72 IC2.14
SR_DATA3  (via drill 0.6)
  Top 0.406: v36.83,37.59 35.05,39.37 24.13,39.37 23.88,39.62 v20.07,39.62
  Bottom 0.406: IC3.14 41.15,38.71 41.15,37.59 40.89,37.34 37.34,37.34 37.08,37.59 v36.83,37.59 | v20.07,39.62 19.81,39.88 17.78,39.88 17.14,39.24 IC2.9
SR_EN  (via drill 0.6)
  Top 0.406: v11.68,35.56 17.02,35.56 v17.27,35.31 18.54,35.31 19.3,36.07 v24.64,36.07 | v35.56,36.58 33.53,38.61 23.62,38.61 23.37,38.86 21.59,38.86 21.34,38.61 v18.54,38.61
  Bottom 0.406: IC1.13 18.29,20.98 18.29,22.86 17.78,23.37 17.78,32.51 17.27,33.27 v17.27,35.31 17.27,35.56 18.54,36.83 v18.54,38.61 | v11.68,35.56 12.06,35.94 IC2.13 | IC3.13 42.67,38.71 42.67,37.34 41.91,36.58 v35.56,36.58 | U$1.27 24.13,33.57 24.13,35.81 24.38,36.07 v24.64,36.07
SR_LATCH  (via drill 0.6)
  Top 0.406: v12.7,34.04 v16,34.04 v21.34,34.04 | v34.04,36.32 32.51,37.85 v22.61,37.85
  Bottom 0.406: IC1.12 17.02,20.98 17.02,22.61 16.76,22.86 16.76,30.23 17.02,30.73 17.02,31.75 16,33.02 v16,34.04 | v12.7,34.04 12.7,35.05 13.34,35.69 IC2.12 | IC3.12 43.94,38.71 43.94,36.83 42.93,35.81 36.58,35.81 36.32,35.56 34.8,35.56 v34.04,36.32 | v22.61,37.85 v22.6,37.84 U$1.25 22.07,34.04 v21.34,34.04
VCC  (via drill 0.6)
  Top 0.406: v34.8,19.81 34.29,19.3 27.94,19.3 27.69,19.56 23.88,19.56 23.62,19.81 v23.37,19.81 22.35,19.81 22.1,20.07 9.06,20.07 J2.GND@2 8.51,17.82 J2.GND@1 | v17.27,43.69 v21.84,43.69 | v21.34,48.01 20.83,48.51 20.83,49.02 20.32,49.53 v8.38,49.53 | v50.04,41.4 55.37,41.4 55.88,41.91 | 55.88,41.91 J1.2 | JP4.6 55.88,41.91 | v42.16,19.56 54.1,19.56 55.37,18.29 v55.63,18.29 | JP6.1 8.38,37.34 v2.03,37.34
  Bottom 0.406: 26.16,28.7 21.21,28.7 U$1.20 21,28.7 20.07,28.7 19.3,27.94 19.3,27.43 | 19.3,27.43 19.53,27.21 U$1.18 | 19.3,27.43 19.56,27.18 19.56,24.38 22.23,21.72 IC1.16 23.27,19.81 v23.37,19.81 23.37,18.68 C4.1 | IC3.16 37.22,38.84 C1.1 32.88,38.97 31.24,37.34 31.24,34.8 34.04,32 34.04,31.24 32.77,29.97 32.77,28.96 31.75,27.94 31.75,28.31 C6.1 30.95,28.01 U$1.6 28.52,28.01 27.94,27.43 27.18,27.43 26.42,28.19 26.42,28.45 26.16,28.7 | 26.16,28.7 26.42,28.96 26.42,29.46 26.92,29.97 27.69,29.97 27.94,29.72 28.96,29.72 29.06,29.61 U$1.4 | v42.16,19.56 42.16,19.05 41.91,18.8 39.88,18.8 38.1,20.57 35.56,20.57 v34.8,19.81 34.8,19.56 33.02,17.78 33.02,11.68 JP3.6 | ULN2803.10 54.1,18.09 54.1,20.32 55.01,21.22 C5.1 57.4,22.49 57.4,35.56 56.39,36.58 JP4.6 | C7.1 18.65,43.69 v17.27,43.69 14.99,43.69 13.97,42.67 8.64,42.67 8.13,42.16 8.13,39.73 IC2.16 8.13,39.47 8.13,37.59 JP6.1 | JP5.1 36.32,55.12 49.28,55.12 51.05,53.34 51.05,46.74 50.29,45.97 50.29,43.18 50.04,42.93 v50.04,41.4 | R25.2 55.51,51.31 56.64,51.31 57.4,50.55 57.4,45.21 56.64,44.45 J1.2 | C13.1 53.98,16.2 ULN2803.10 | v55.63,18.29 55.3,17.96 ULN2803.10 | C12.1 8.38,54.43 v8.38,49.53 | C11.1 5.21,9.09 J2.GND@1 2.29,17.45 2.29,36.58 2.03,36.83 v2.03,37.34 | v21.84,43.69 21.84,47.5 v21.34,48.01

### Text on the board
tPlace: 32 | Matrix Board v2 | Evan Green 1/2011 | 1
bPlace: GND | VCC | 1 | AVR | VCC | VCC | Matrix Board v2 | CS | CS | MOSI | MOSI | MISO | MISO | CLK | CLK | GND | GND | +5V | GND | VCC | Evan Green 1/2011